# EAGLE design 7segement4digits1badidea-feathershield-mk-1.2 (EAGLE 7.5.0)
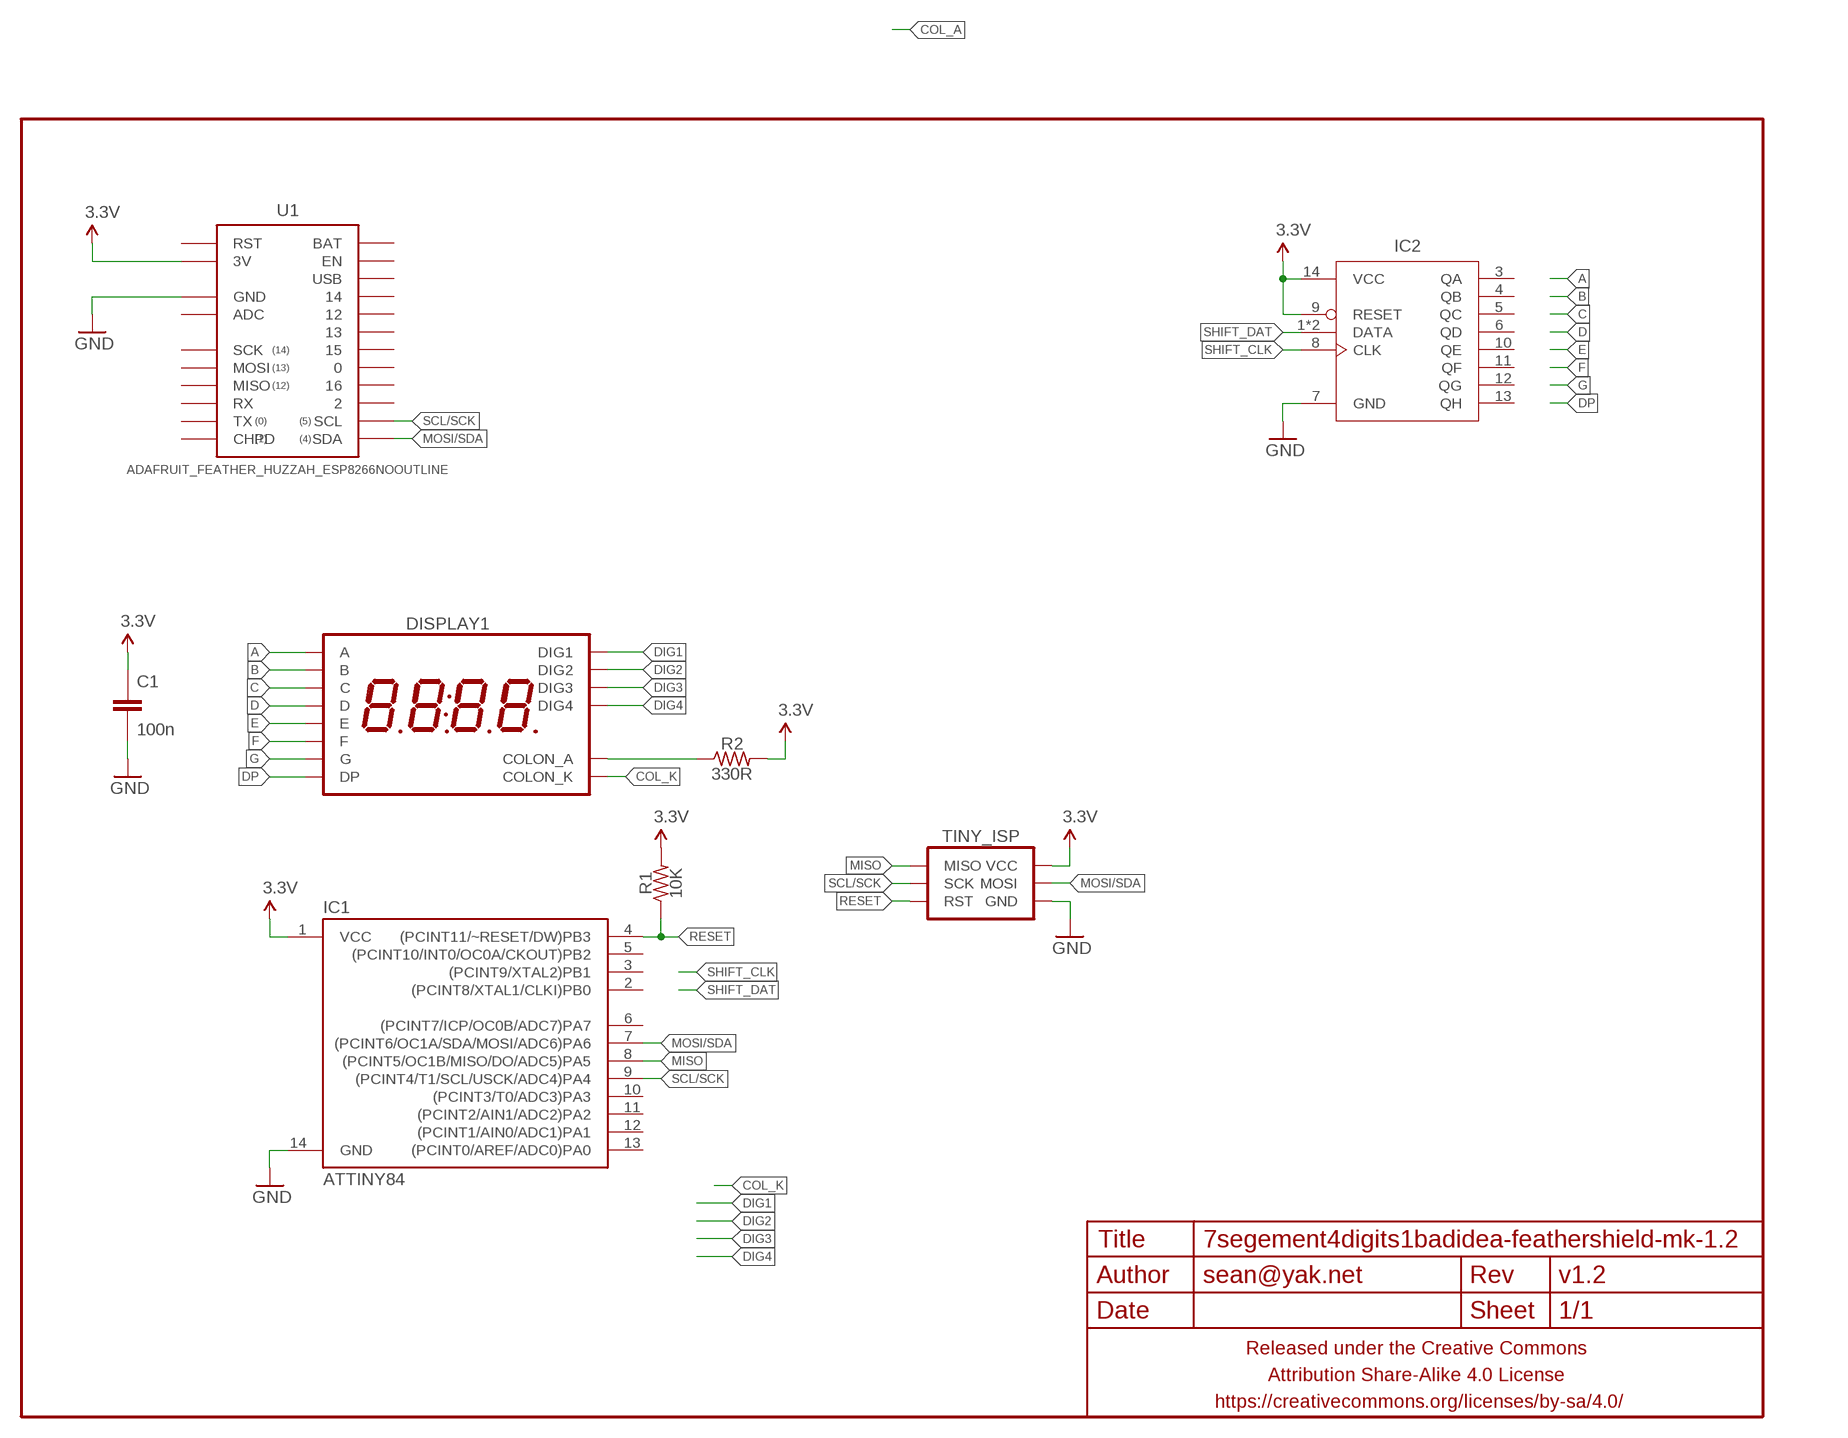
[diagram p0: schematic, sheet 1]

## Parts
C1  100n  CAPACITOR-CERAMICC0603  [C0603]
DISPLAY1  7SEG_4DIGIT_COLON14.2MM-CC  [7SEG_4DIG_0.56IN_14MM_ADAFRUIT]
FRAME1  FRAME-LETTERNO_PACKAGE  [DUMMY]
IC1  ATTINY84  [SO14]
IC2  74HC164  74164SOIC  [SO14]
R1  10K  RESISTORR0603  [R0603]
R2  330R  RESISTORR0603  [R0603]
TINY_ISP  AVR_SPI_PRG_6TESTPOINTS  [2X3_TEST_POINTS]
U1  ADAFRUIT_FEATHER_HUZZAH_ESP8266NOOUTLINE  [ADAFRUIT_FEATHER_HUZZAH_NOOUTLINE]

## Nets
3.3V: C1.1 IC1.1(VCC) IC2.9(RESET) IC2.14(VCC) R1.2 R2.2 TINY_ISP.2(VCC) U1.3V
A: DISPLAY1.P$13(A)
B: DISPLAY1.P$9(B)
C: DISPLAY1.P$4(C)
COL_K: DISPLAY1.P$7(COLON_K)
D: DISPLAY1.P$2(D)
DIG1: DISPLAY1.P$14(DIG1)
DIG2: DISPLAY1.P$11(DIG2)
DIG3: DISPLAY1.P$10(DIG3)
DIG4: DISPLAY1.P$6(DIG4)
DP: DISPLAY1.P$3(DP)
E: DISPLAY1.P$1(E)
F: DISPLAY1.P$12(F)
G: DISPLAY1.P$5(G)
GND: C1.2 IC1.14(GND) IC2.7(GND) TINY_ISP.6(GND) U1.GND@0(GND)
MISO: IC1.8((PCINT5/OC1B/MISO/DO/ADC5)PA5) TINY_ISP.1(MISO)
MOSI/SDA: IC1.7((PCINT6/OC1A/SDA/MOSI/ADC6)PA6) TINY_ISP.4(MOSI) U1.SDA
N$4: DISPLAY1.P$8(COLON_A) R2.1
RESET: IC1.4((PCINT11/~RESET/DW)PB3) R1.1 TINY_ISP.5(RST)
SCL/SCK: IC1.9((PCINT4/T1/SCL/USCK/ADC4)PA4) TINY_ISP.3(SCK) U1.SCL
SHIFT_CLK: IC2.8(CLK)
SHIFT_DAT: IC2.1(DATA) IC2.2(DATA)
Unconnected: IC1.2((PCINT8/XTAL1/CLKI)PB0) IC1.3((PCINT9/XTAL2)PB1) IC1.5((PCINT10/INT0/OC0A/CKOUT)PB2) IC1.6((PCINT7/ICP/OC0B/ADC7)PA7) IC1.10((PCINT3/T0/ADC3)PA3) IC1.11((PCINT2/AIN1/ADC2)PA2) IC1.12((PCINT1/AIN0/ADC1)PA1) IC1.13((PCINT0/AREF/ADC0)PA0) IC2.3(QA) IC2.4(QB) IC2.5(QC) IC2.6(QD) IC2.10(QE) IC2.11(QF) IC2.12(QG) IC2.13(QH) U1.0 U1.2 U1.12 U1.13 U1.14 U1.15 U1.16 U1.ADC U1.BAT U1.CHPD U1.EN U1.MISO U1.MOSI U1.RST U1.RX U1.SCK U1.TX U1.USB

## Library data of the parts
C1 = A_butts:CAPACITOR-CERAMIC: CAPACITOR, European symbol
DISPLAY1 = a_parts:7SEG_4DIGIT_COLON
FRAME1 = A_butts:FRAME-LETTER: Schematic Frame Standard 8.5x11 US Letter frame; DESIGNER: sean@yak.net; VERSION: v1.2
IC1 = a_parts:ATTINY84: Atmel 14-pin 2/4/8kB flash uC
IC2 = a_parts:74*164
R1 R2 = a_parts:RESISTOR: RESISTOR, American symbol
TINY_ISP = a_parts:AVR_SPI_PRG_6: AVR ISP 6 Pin This is the reduced ISP connector for AVR programming. Common on Arduino. This footprint will take up less PCB space and can be used with a 10-pin to 6-pin adapter such as SKU: BOB-08508 **Special note about "TEST_POINT" package. The stop mask is on the top side, so if you want your programming test points to be on the bottom of your board, make sure to place this package on the bottom side of the board. This also ensure that the orientation to program from the bottom side will be correct.
U1 = a_parts:ADAFRUIT_FEATHER_HUZZAH_ESP8266

## Board
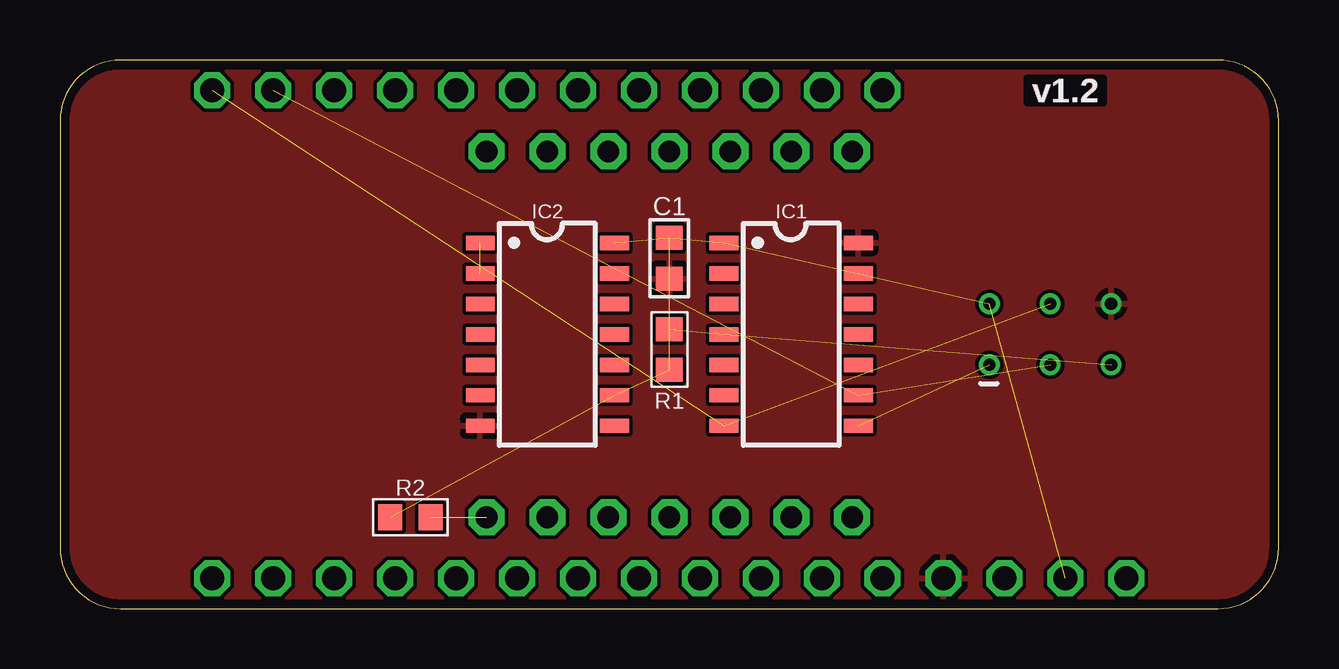
[diagram p1: board, top side]
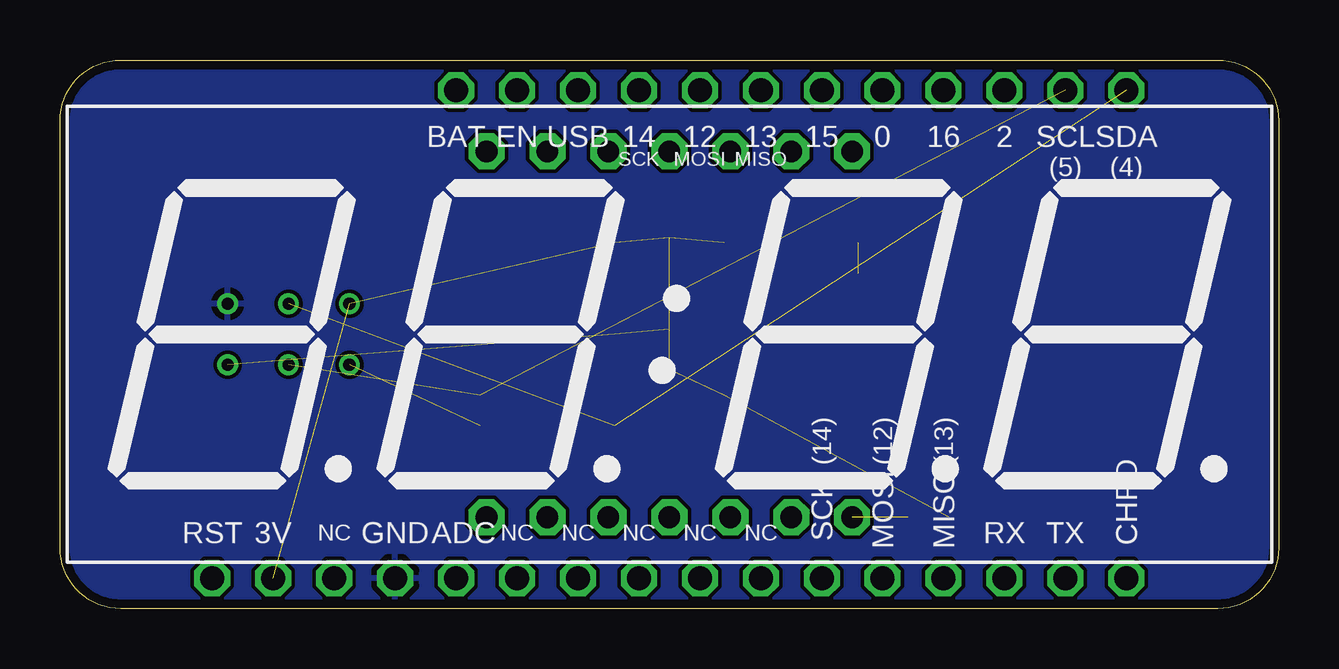
[diagram p2: board, bottom side, seen from below]

Size 50.8 x 22.86 mm. Coordinates in mm from the lower left corner, seen from the top.
Outline: 0,20.32 0,2.54 arc90 2.54,0 48.26,0 arc90 50.8,2.54 50.8,20.32 arc90 48.26,22.86 2.54,22.86 arc90 0,20.32
Copper layers (1*16): Top 0.0356mm / dielectric 1.5011mm / Bottom 0.0356mm
Design rules "LaenPCBOrder_2": minimum track width 6mil, minimum drill 13mil, track to track 6mil, track to pad 6mil, pad to pad 6mil, via to via 6mil, smd to smd 6mil, copper to edge 15mil, drill to drill 6mil, minimum pad ring 7mil, minimum via ring 7mil, stop-mask expansion 3mil, vias tented up to drill 20mil, thermal gap 10mil

### Footprints (pad centres in the part's own frame; a part is rotated, then mirrored left to right if it is on the bottom)
C0603 = smd 1 x 1.1: 1 -0.85,0; 2 0.85,0
7SEG_4DIG_0.56IN_14MM_ADAFRUIT = drill 0.9 pad 1.5 octagon: P$1 -7.62,7.62; P$2 -5.08,7.62; P$3 -2.54,7.62; P$4 0,7.62; P$5 2.54,7.62; P$6 5.08,7.62; P$7 7.62,7.62; P$8 7.62,-7.62; P$9 5.08,-7.62; P$10 2.54,-7.62; P$11 0,-7.62; P$12 -2.54,-7.62; P$13 -5.08,-7.62; P$14 -7.62,-7.62
SO14 = smd 0.6 x 1.2: 1 -3.81,-2.8; 2 -2.54,-2.8; 3 -1.27,-2.8; 4 0,-2.8; 5 1.27,-2.8; 6 2.54,-2.8; 7 3.81,-2.8; 8 3.81,2.8; 9 2.54,2.8; 10 1.27,2.8; 11 0,2.8; 12 -1.27,2.8; 13 -2.54,2.8; 14 -3.81,2.8
R0603 = smd 1 x 1.1: 1 -0.85,0; 2 0.85,0
2X3_TEST_POINTS = drill 0.508: 1 -2.54,-1.27; 2 -2.54,1.27; 3 0,-1.27; 4 0,1.27; 5 2.54,-1.27; 6 2.54,1.27
ADAFRUIT_FEATHER_HUZZAH_NOOUTLINE = drill 1 pad 1.5 octagon: 0 8.89,10.16; 2 13.97,10.16; 3V -16.51,-10.16; 12 1.27,10.16; 13 3.81,10.16; 14 -1.27,10.16; 15 6.35,10.16; 16 11.43,10.16; ADC -8.89,-10.16; BAT -8.89,10.16; CHPD 19.05,-10.16; EN -6.35,10.16; GND@0 -11.43,-10.16; MISO 11.43,-10.16; MOSI 8.89,-10.16; NC@3 -13.97,-10.16; NC@6 -6.35,-10.16; NC@7 -3.81,-10.16; NC@8 -1.27,-10.16; NC@9 1.27,-10.16; NC@10 3.81,-10.16; RST -19.05,-10.16; RX 13.97,-10.16; SCK 6.35,-10.16; SCL 16.51,10.16; SDA 19.05,10.16; TX 16.51,-10.16; USB -3.81,10.16

### Placement (x,y rotation side)
C1  25.4,14.61 270 top
DISPLAY1  25.4,11.43 0 bottom
FRAME1  0,-0.5 0 top
IC1  30.48,11.43 270 top
IC2  20.32,11.43 270 top
R1  25.4,10.79 270 top
R2  14.61,3.81 180 top
TINY_ISP  41.27,11.43 0 top
U1  25.4,11.43 0 bottom

### Tracks (layer width: path | path; a pad name or v marks a point on that pad's centre or on a via)
3.3V  (7 unrouted)
GND
  pour Top: 48.26,0 2.54,0 arc-90 0,2.54 0,20.32 arc-90 2.54,22.86 48.26,22.86 arc-90 50.8,20.32 50.8,2.54 arc-90
  pour Bottom: 50.8,20.32 50.8,2.54 arc-90 48.26,0 2.54,0 arc-90 0,2.54 0,20.32 arc-90 2.54,22.86 48.26,22.86 arc-90
MISO  (1 unrouted)
MOSI/SDA  (2 unrouted)
N$4  (1 unrouted)
RESET  (2 unrouted)
SCL/SCK  (2 unrouted)
SHIFT_DAT  (1 unrouted)